# Altium project PCB Clape.PrjPcb
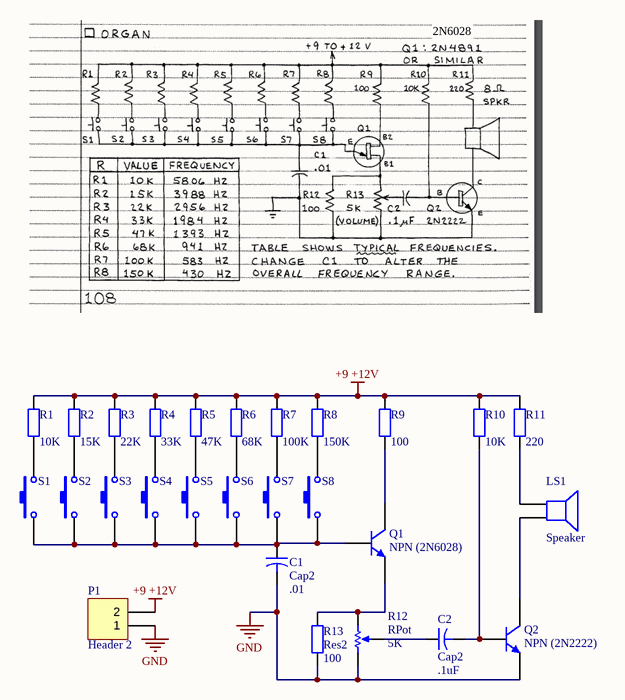
[diagram p0: Clape SCH.SchDoc]
1 sheet, 27 parts. Net scope: global (net labels, ports and power ports of the same name join across sheets).
Board file: PCB Clape.PcbDoc

## Sheet Clape SCH.SchDoc
size 594 x 420 mm

### Parts
C1  Cap2  value .01  [CAPR5-4X5]
C2  Cap2  value .1uF  [CAPR5-4X5]
LS1  Speaker  [PIN2]
P1  Header 2  [HDR1X2]
Q1  NPN (2N6028)  [TO-226-AA]
Q2  NPN (2N2222)  [TO-226-AA]
R1  value 10K  [AXIAL-0.4]  (hidden comment: Res2)
R2  value 15K  [AXIAL-0.4]  (hidden comment: Res2)
R3  value 22K  [AXIAL-0.4]  (hidden comment: Res2)
R4  value 33K  [AXIAL-0.4]  (hidden comment: Res2)
R5  value 47K  [AXIAL-0.4]  (hidden comment: Res2)
R6  value 68K  [AXIAL-0.4]  (hidden comment: Res2)
R7  value 100K  [AXIAL-0.4]  (hidden comment: Res2)
R8  value 150K  [AXIAL-0.4]  (hidden comment: Res2)
R9  value 100  [AXIAL-0.4]  (hidden comment: Res2)
R10  value 10K  [AXIAL-0.4]  (hidden comment: Res2)
R11  value 220  [AXIAL-0.4]  (hidden comment: Res2)
R12  RPot  value 5K  [VR5]
R13  Res2  value 100  [AXIAL-0.4]
S1  SW-PB  [SPST-2]  (value not drawn)
S2  SW-PB  [SPST-2]  (value not drawn)
S3  SW-PB  [SPST-2]  (value not drawn)
S4  SW-PB  [SPST-2]  (value not drawn)
S5  SW-PB  [SPST-2]  (value not drawn)
S6  SW-PB  [SPST-2]  (value not drawn)
S7  SW-PB  [SPST-2]  (value not drawn)
S8  SW-PB  [SPST-2]  (value not drawn)

### Nets
+9 +12V: P1.2 R1.2 R2.2 R3.2 R4.2 R5.2 R6.2 R7.2 R8.2 R9.2 R10.2 R11.2
GND: C1.2 P1.1 Q2.3(E) R12.1(TOP) R13.1
NetC1_1: C1.1 Q1.2(B) S1.1 S2.1 S3.1 S4.1 S5.1 S6.1 S7.1 S8.1
NetC2_1: C2.1 R12.3(TAP)
NetC2_2: C2.2 Q2.2(B) R10.1
NetLS1_1: LS1.1 R11.1
NetLS1_2: LS1.2 Q2.1(C)
NetQ1_1: Q1.1(C) R9.1
NetQ1_3: Q1.3(E) R12.2(BOT) R13.2
NetR1_1: R1.1 S1.2
NetR2_1: R2.1 S2.2
NetR3_1: R3.1 S3.2
NetR4_1: R4.1 S4.2
NetR5_1: R5.1 S5.2
NetR6_1: R6.1 S6.2
NetR7_1: R7.1 S7.2
NetR8_1: R8.1 S8.2

### Notes on the sheet
- 2N6028
- DWG NO:
- REV:
- THIS DOCUMENT AND THE DATA DISCLOSED HEREIN OR
- HEREWITH IS THE PROPERTY OF ALTIUM LIMITED AND MAY
- BE FREELY DISTRIBUTED IN WHOLE. NO RIGHTS ARE
- RESERVED OR EXPRESS OR IMPLIED WARANTEE GIVEN.
- REVISION
- DESCRIPTION
- DATE
- APPROVED
- ENG:
- APPROVALS
- PROJECT
- DSN:
- CHK:
- REFERENCE DOCUMENTS
- PROJECT REVISION:
- TITLE
- DOCUMENT REVISION:
- DESIGN ITEM:
- BOM:
- FAB DWG:
- PCB DWG:
- ASSY DWG:
- SCALE:
- A2
- SIZE
- CAGE CODE
- FILE NAME
- DWG NO.
- SHEET
- OF
- REV

### Library data of the parts
C1 C2 = Cap2: Capacitor; Published: 23-Sep-2002; PackageReference: CAPR5-4X5; Publisher: Altium Limited; PackageDescription: Capacitor; 2 Leads
LS1 = Speaker: Loudspeaker; Published: 24-Mar-1999; LatestRevisionDate: 17-Jul-2002; LatestRevisionNote: Re-released for DXP Platform.; PackageReference: PIN2; Publisher: Altium Limited
P1 = Header 2: Header, 2-Pin; LatestRevisionDate: 17-Jul-2002; LatestRevisionNote: Re-released for DXP Platform.; Publisher: Altium Limited
Q1 Q2 = NPN: NPN Bipolar Transistor; Published: 8-Jun-2000; LatestRevisionDate: 17-Jul-2002; LatestRevisionNote: Re-released for DXP Platform.; PackageReference: TO-226-AA; Publisher: Altium Limited; PackageDescription: TO, Flat Index; 3 In-Line, Axial Leads; Body Dia. 4.8mm; Leads 0.55 x 0.51 mm (max); Code_JEDEC: TO-226-AA
R1-R11 R13 = Res2: Resistor; Published: 8-Jun-2000; LatestRevisionDate: 17-Jul-2002; LatestRevisionNote: Re-released for DXP Platform.; PackageReference: AXIAL-0.4; Publisher: Altium Limited; PackageDescription: Axial Device, Thru-Hole; 2 Leads; 0.4 in Pin Spacing
R12 = RPot: Potentiometer; Sim Note: Enter the Resistance value and the set point into parameter fields.; Set Position: 0.5; Published: 8-Jun-2000; LatestRevisionDate: 17-Jul-2002; LatestRevisionNote: Re-released for DXP Platform.; PackageReference: VR5; Publisher: Altium Limited; PackageDescription: Variable Resistor, Thru-Hole; 3 Leads
S1-S8 = SW-PB: Switch; Published: 24-Mar-1999; LatestRevisionDate: 17-Jul-2002; LatestRevisionNote: Re-released for DXP Platform.; PackageReference: SPST-2; Publisher: Altium Limited; PackageDescription: Switch; 2 Leads